# Altium schematic sheet LEVEL_TRANSLATORS.SchDoc: Level Translators
size A3; DocumentNumber: 7; SheetNumber: 7; SheetTotal: 12
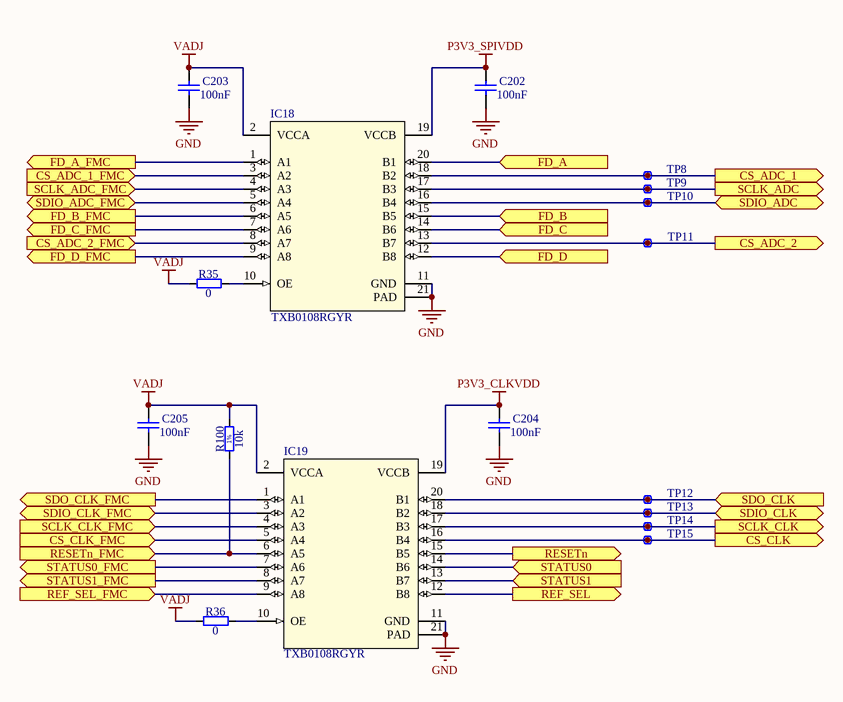
[diagram p0: LEVEL_TRANSLATORS.SchDoc]

## Parts
C202  100nF  [CAPC0603X33N]
C203  100nF  [CAPC0603X33N]
C204  100nF  [CAPC0603X33N]
C205  100nF  [CAPC0603X33N]
IC18  TXB0108RGYR  [RGY20_3P05x2P05]
IC19  TXB0108RGYR  [RGY20_3P05x2P05]
R35  0  [RESC1005X40N]
R36  0  [RESC1005X40N]
R100  10k  [RESC1005X40N]
TP8  Test Point  [TPS62]  (value not drawn)
TP9  Test Point  [TPS62]  (value not drawn)
TP10  Test Point  [TPS62]  (value not drawn)
TP11  Test Point  [TPS62]  (value not drawn)
TP12  Test Point  [TPS62]  (value not drawn)
TP13  Test Point  [TPS62]  (value not drawn)
TP14  Test Point  [TPS62]  (value not drawn)
TP15  Test Point  [TPS62]  (value not drawn)

## Ports
CS_ADC_1 (out), CS_ADC_1_FMC (in), CS_ADC_2 (out), CS_ADC_2_FMC (in), CS_CLK (out), CS_CLK_FMC (in), FD_A (in), FD_A_FMC (out), FD_B (in), FD_B_FMC (out), FD_C (in), FD_C_FMC (out), FD_D (in), FD_D_FMC (out), REF_SEL (out), REF_SEL_FMC (in), RESETn (out), RESETn_FMC (in), SCLK_ADC (out), SCLK_ADC_FMC (in), SCLK_CLK (out), SCLK_CLK_FMC (in), SDIO_ADC (bidir), SDIO_ADC_FMC (bidir), SDIO_CLK (bidir), SDIO_CLK_FMC (bidir), SDO_CLK (in), SDO_CLK_FMC (out), STATUS0 (in), STATUS0_FMC (out), STATUS1 (in), STATUS1_FMC (out)

## Nets
GND: C202.1 C203.1 C204.1 C205.1 IC18.11(GND) IC18.21(PAD) IC19.11(GND) IC19.21(PAD)
P3V3_CLKVDD: C204.2 IC19.19(VCCB)
P3V3_SPIVDD: C202.2 IC18.19(VCCB)
VADJ: C203.2 C205.2 IC18.2(VCCA) IC19.2(VCCA) R35.1 R36.1 R100.2
CS_ADC_1: IC18.18(B2) TP8.1 ; port CS_ADC_1
CS_ADC_1_FMC: IC18.3(A2) ; port CS_ADC_1_FMC
CS_ADC_2: IC18.13(B7) TP11.1 ; port CS_ADC_2
CS_ADC_2_FMC: IC18.8(A7) ; port CS_ADC_2_FMC
CS_CLK: IC19.16(B4) TP15.1 ; port CS_CLK
CS_CLK_FMC: IC19.5(A4) ; port CS_CLK_FMC
FD_A: IC18.20(B1) ; port FD_A
FD_A_FMC: IC18.1(A1) ; port FD_A_FMC
FD_B: IC18.15(B5) ; port FD_B
FD_B_FMC: IC18.6(A5) ; port FD_B_FMC
FD_C: IC18.14(B6) ; port FD_C
FD_C_FMC: IC18.7(A6) ; port FD_C_FMC
FD_D: IC18.12(B8) ; port FD_D
FD_D_FMC: IC18.9(A8) ; port FD_D_FMC
REF_SEL: IC19.12(B8) ; port REF_SEL
REF_SEL_FMC: IC19.9(A8) ; port REF_SEL_FMC
RESETn: IC19.15(B5) ; port RESETn
RESETn_FMC: IC19.6(A5) R100.1 ; port RESETn_FMC
SCLK_ADC: IC18.17(B3) TP9.1 ; port SCLK_ADC
SCLK_ADC_FMC: IC18.4(A3) ; port SCLK_ADC_FMC
SCLK_CLK: IC19.17(B3) TP14.1 ; port SCLK_CLK
SCLK_CLK_FMC: IC19.4(A3) ; port SCLK_CLK_FMC
SDIO_ADC: IC18.16(B4) TP10.1 ; port SDIO_ADC
SDIO_ADC_FMC: IC18.5(A4) ; port SDIO_ADC_FMC
SDIO_CLK: IC19.18(B2) TP13.1 ; port SDIO_CLK
SDIO_CLK_FMC: IC19.3(A2) ; port SDIO_CLK_FMC
SDO_CLK: IC19.20(B1) TP12.1 ; port SDO_CLK
SDO_CLK_FMC: IC19.1(A1) ; port SDO_CLK_FMC
STATUS0: IC19.14(B6) ; port STATUS0
STATUS0_FMC: IC19.7(A6) ; port STATUS0_FMC
STATUS1: IC19.13(B7) ; port STATUS1
STATUS1_FMC: IC19.8(A7) ; port STATUS1_FMC
NetIC18_10: IC18.10(OE) R35.2
NetIC19_10: IC19.10(OE) R36.2

## Notes on the sheet
- Title
- Size:
- Date:
- A3
- Number:
- Revision:
- Sheet
- of
- Drawn by:
- File:
- (in symbol R0402_10K_1%_0.0625W_100PPM) 1%

## Library data of the parts
C202-C205 = CC0201_100NF_6.3V_10%_X5R: Non-polarised capacitor; Part Description: SMD Multilayer Chip Ceramic Capacitor; Manufacturer: GENERIC; Manufacturer1 Part Number: 02016D104KAT2A; Tolerance: ±10%; Voltage: 6.3V; TC: X5R; Value: 100nF; Part Number: CC0201_100NF_6.3V_10%_X5R; Component Kind: Standard; Component Type: Standard; Pin Count: 2; Status: Not Recommended; Manufacturer Part Number: CC0201_100NF_6.3V_10%_X5R; Case: 0201; Mounted: Yes; Socket: No; SMD: Yes; Sense: No; Manufacturer1 Example: AVX; Manufacturer1 ComponentHeight: 0.33mm; HelpURL: \\cern.ch\dfs\Applications\Altium\Datasheets\CC0201_X5R_AVX.pdf; Author: CERN DEM JLC; CreateDate: 03.12.2007; LatestRevisionDate: 03.12.2007
IC18 IC19 = TXB0108RGYR: 8-Bit Bidirectional Voltage-Level Translator with Auto-Direction Sensing; Manufacturer: Texas Instruments; Application_BuildNumber: *; PackageReference: RGY0020A; RoHS: Y; Manufacturer Part Number: TXB0108RGYR
R35 R36 = R0402_0R_JUMPER: Resistor; Part Description: 1A (0.05R Max DC Resistance) Zero Ohm Jumper; Manufacturer: GENERIC; Manufacturer1 Part Number: 232270591001L; Part Number: R0402_0R_JUMPER; Component Kind: Standard; Component Type: Standard; Pin Count: 2; Value: 0; Status: Not recommended; Manufacturer Part Number: R0402_0R_JUMPER; Case: 0402; Mounted: Yes; Sense: No; Socket: No; SMD: Yes; Manufacturer1 Example: YAGEO PHYCOMP; Manufacturer1 ComponentHeight: 0.4mm; HelpURL: \\cern.ch\dfs\Applications\Altium\Datasheets\R0402_Phycomp_RC0402.pdf; Author: CERN DEM JLC; CreateDate: 03.12.2007; LatestRevisionDate: 17.10.2012
R100 = R0402_10K_1%_0.0625W_100PPM: Resistor - 1%; Part Description: General Purpose Thick Film Chip Resistor; Manufacturer: GENERIC; Manufacturer1 Part Number: 232270671003L; TC: ±100ppm/°C; Part Number: R0402_10K_1%_0.0625W_100PPM; Component Kind: Standard; Component Type: Standard; Pin Count: 2; Value: 10k; Status: Not recommended; Power: 0.0625W; Tolerance: ±1%; Manufacturer Part Number: R0402_10K_1%_0.0625W_100PPM; Case: 0402; Mounted: Yes; Sense: No; Socket: No; SMD: Yes; Manufacturer1 Example: YAGEO PHYCOMP; Manufacturer1 ComponentHeight: 0.4mm; HelpURL: \\cern.ch\dfs\Applications\Altium\Datasheets\R0402_Phycomp_RC0402.pdf; Author: CERN DEM JLC; CreateDate: 03.12.2007; LatestRevisionDate: 17.10.2012
TP8-TP15 = SMD_PAD_0.62X0.62MM: Part Description: 0.62mm x 0.62mm PCB Copper Area (SMD Test Point); Mounted: No; Part Number: SMD_PAD_0.62X0.62MM; Component Kind: Standard (No BOM); Component Type: Standard (No BOM); Pin Count: 1; Family: Test Point; Socket: No; SMD: Yes; Sense: No; Status: None; ComponentHeight: 0mm; HelpURL: Undefined; Author: CERN DEM JLC; CreateDate: 12.01.2008; LatestRevisionDate: 12.01.2008; PackageDescription: 0.62mm x 0.62mm PCB Copper Area (SMD Test Point)